# EAGLE design RoverPower (EAGLE 7.1.0)
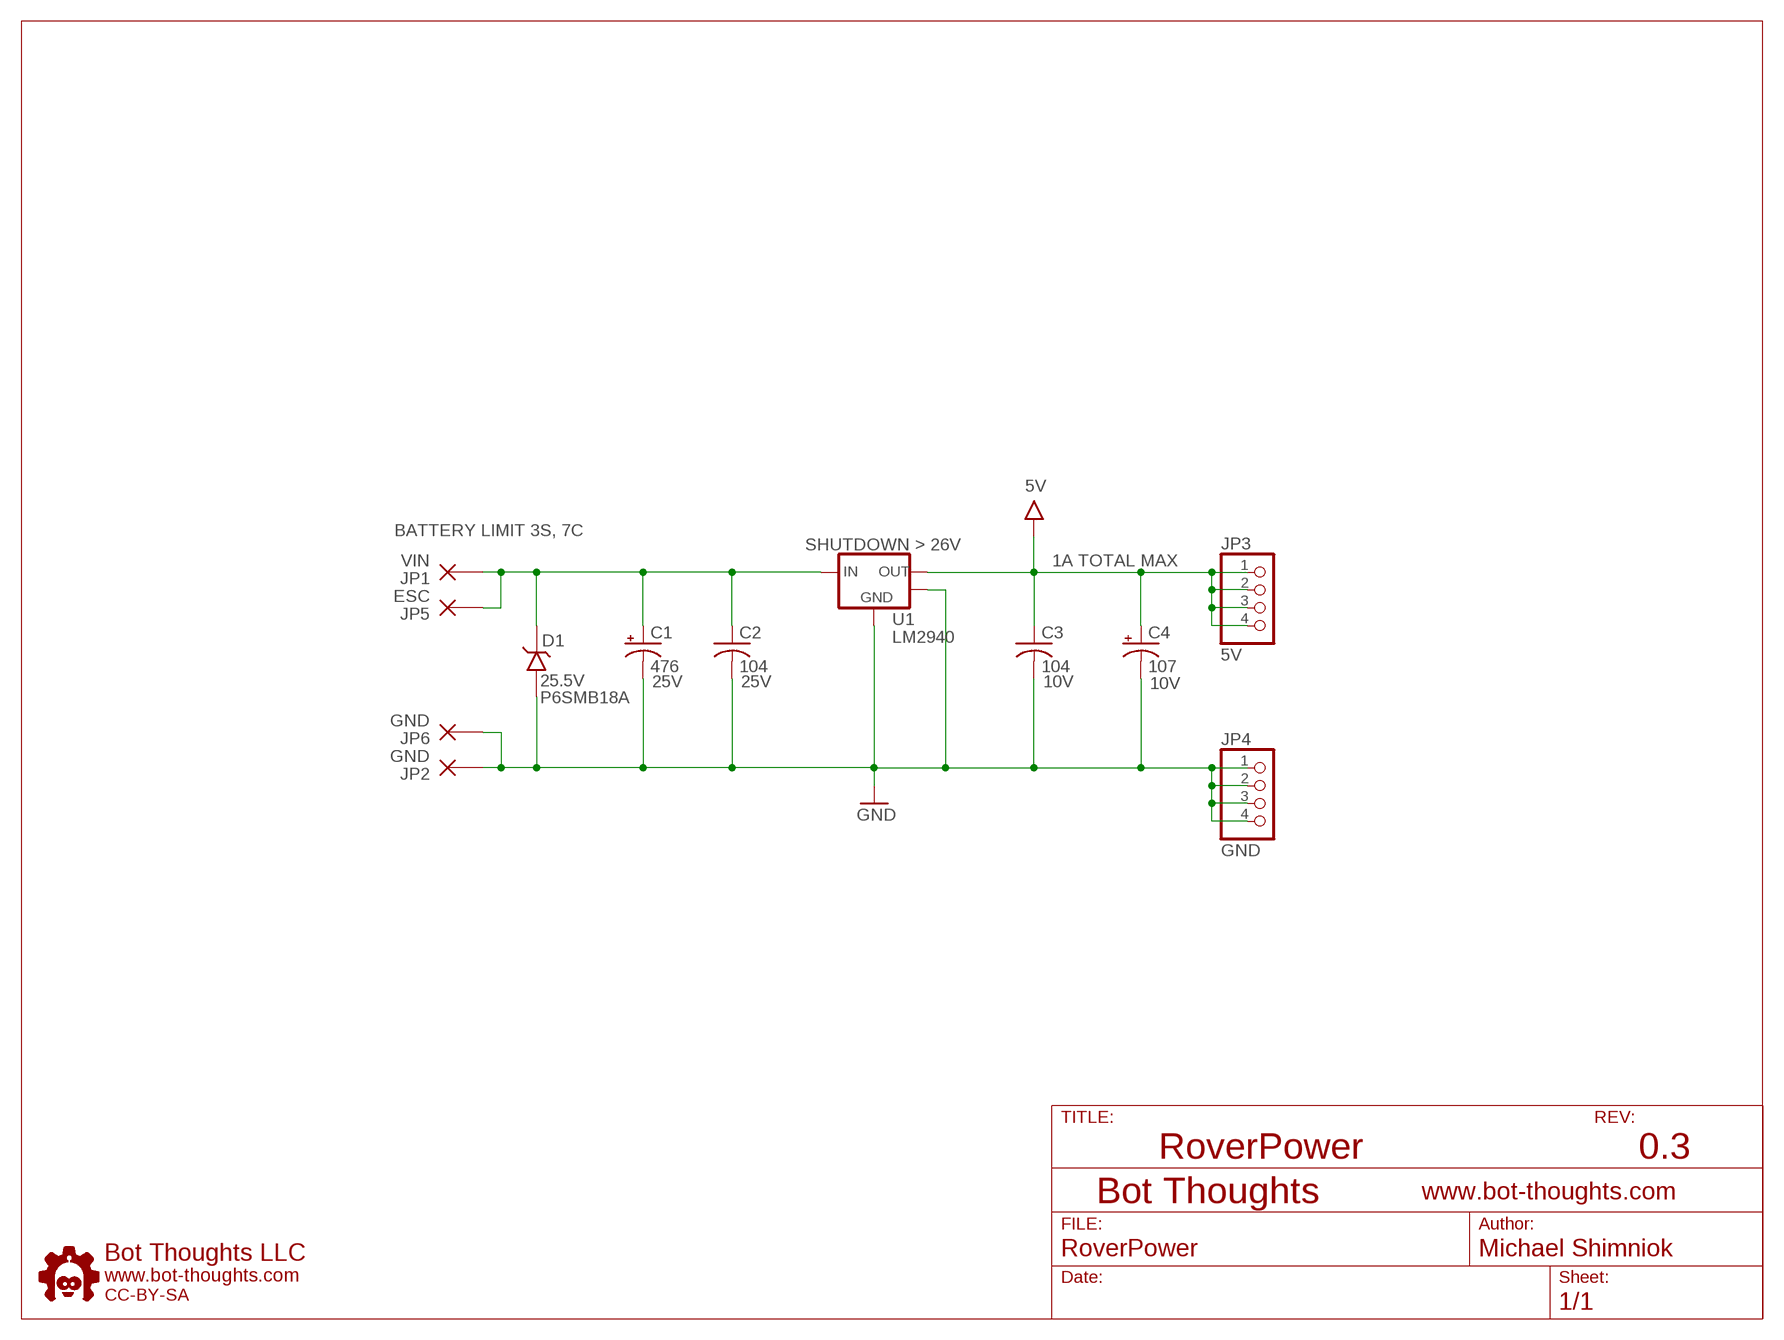
[diagram p0: schematic, sheet 1]

## Parts
C1  476  CPOL-USE2.5-6  [E2,5-6]
C2  104  C-USC0603  [C0603]
C3  104  C-USC0603  [C0603]
C4  107  CPOL-USSMCB  [SMC_B]
D1  25.5V  P6SMBXXAT3GSMA  [DO-214AA]
JP1  VIN  WIREPAD_12GA  [PAD_12GA]
JP2  GND  WIREPAD_12GA  [PAD_12GA]
JP3  5V  PINHD-1X04_2.54-S  [1X04-S]
JP4  GND  PINHD-1X04_2.54-S  [1X04-S]
JP5  ESC  WIREPAD_12GA  [PAD_12GA]
JP6  GND  WIREPAD_12GA  [PAD_12GA]
U1  LM2940  LM2940KTT  [TO263-3]
U$2  BTLOGO-LOGO-MD  [BTLOGOM]

## Nets
5V: C3.1 C4.+ JP3.1 JP3.2 JP3.3 JP3.4 U1.3(VOUT)
BAT+: C1.+ C2.1 D1.P$1(C) JP1.P$1(P) JP5.P$1(P) U1.1(VIN)
GND: C1.- C2.2 C3.2 C4.- D1.P$2(A) JP2.P$1(P) JP4.1 JP4.2 JP4.3 JP4.4 JP6.P$1(P) U1.2(GND) U1.4(TAB)

## Notes on the sheet
- BATTERY LIMIT 3S, 7C
- SHUTDOWN > 26V
- 1A TOTAL MAX
- RoverPower | 0.3

## Library data of the parts
C1 = rcl:CPOL-US: POLARIZED CAPACITOR, American symbol; PARTNO: EEU-FC1H470; VOLTAGE: 25V
C2 = rcl:C-US: CAPACITOR, American symbol; VOLTAGE: 25V
C3 = rcl:C-US: CAPACITOR, American symbol; VOLTAGE: 10V
C4 = rcl:CPOL-US: POLARIZED CAPACITOR, American symbol; VOLTAGE: 10V
D1 = bt_diode:P6SMBXXAT3G: SMBxxAT3G TVS Diode The SMB series is designed to protect voltage sensitive components from high voltage, high energy transients. They have excellent clamping capability, high surge capability, low zener impedance and fast response time. The SMB series is supplied in ON Semiconductor’s exclusive, cost-effective, highly reliable SURMETIC® package and is ideally suited for use in communication systems, automotive, numerical controls, process controls, medical equipment, business machines, power supplies and many other industrial/consumer applications. http://www.onsemi.com/pub_link/Collateral/P6SMB6.8AT3-D.PDF <datasheet.pdf>; PARTNO: P6SMB18A
JP1 JP2 JP5 JP6 = bt_electromech:WIREPAD: PIN PAD (PINPAD) Generic pin pad connector
JP3 JP4 = pinhead-2:PINHD-1X04: PIN HEADER
U1 = bt_regulator:LM2940: LM2940 LDO Voltage Regulator The LM2940-N/LM2940C positive voltage regulator features the ability to source 1A of output current with a dropout voltage of typically 0.5V and a maximum of 1V over the entire temperature range. Furthermore, a quiescent current reduction circuit has been included which reduces the ground current when the differential between the input voltage and the output exceeds approximately 3V. Designed also for vehicular applications, the LM2940-N/LM2940C and all regulated circuitry are protected from reverse battery installations or 2-battery jumps. During line transients, such as load dump when the input voltage can momentarily exceed the specified maximum operating voltage, the regulator will automatically shut down to protect both the internal circuits and the load. The LM2940/LM2940C cannot be harmed by temporary mirror-image insertion. Familiar regulator features such as short circuit and thermal overload protection are also provided. Datasheet.pdf <http://www.ti.com/lit/ds/symlink/lm2940-n.pdf>
U$2 = bt:BTLOGO: Bot Thoughts Logo

## Board
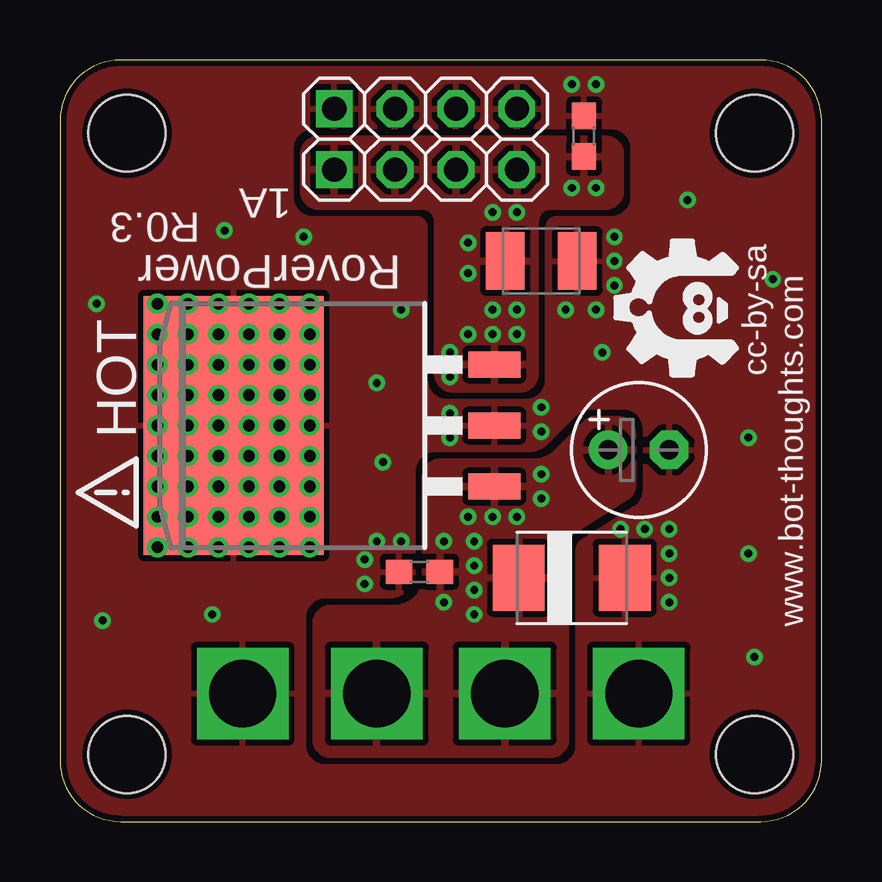
[diagram p1: board, top side]
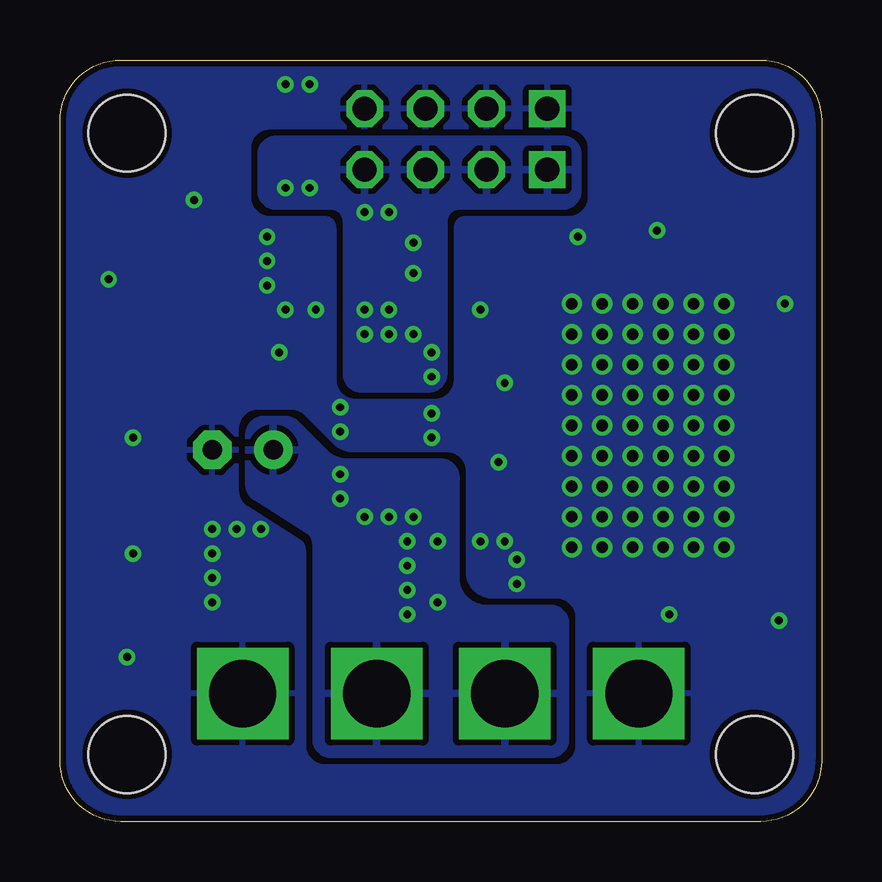
[diagram p2: board, bottom side, seen from below]

Size 31.75 x 31.75 mm. Coordinates in mm from the lower left corner, seen from the top.
Outline: 0,29.21 0,2.54 arc90 2.54,0 29.21,0 arc90 31.75,2.54 31.75,29.21 arc90 29.21,31.75 2.54,31.75 arc90 0,29.21
Copper layers (1*16): Top 0.0356mm / dielectric 1.5011mm / Bottom 0.0356mm
Design rules "LaenPCBOrder": minimum track width 6mil, minimum drill 13mil, track to track 10mil, track to pad 10mil, pad to pad 10mil, via to via 10mil, smd to smd 8mil, copper to edge 10mil, drill to drill 10mil, minimum pad ring 7mil, minimum via ring 7mil, stop-mask expansion 3mil, vias tented up to drill 20mil, thermal gap 10mil
Holes 3.2 mm at 2.79,2.79 28.96,2.79 28.96,28.7 2.79,28.7

### Footprints (pad centres in the part's own frame; a part is rotated, then mirrored left to right if it is on the bottom)
E2,5-6 = drill 0.813 pad 1.6: + -1.27,0 | drill 0.813 pad 1.6 octagon: - 1.27,0
C0603 = smd 1.1 x 1: 1 -0.85,0; 2 0.85,0
SMC_B = smd 1.6 x 2.4: + -1.5,0; - 1.5,0
DO-214AA = smd 2.159 x 2.743: P$1 -2.21,0; P$2 2.21,0
PAD_12GA = drill 2.8 square: P$1 0,0
1X04-S = drill 1.016 square: 1 -3.81,0 | drill 1.016 octagon: 2 -1.27,0; 3 1.27,0; 4 3.81,0
TO263-3 = smd 1.067 x 2.159: 1 -2.54,-7.061; 2 0,-7.061; 3 2.54,-7.061 | smd 10.795 x 7.493: 4 0,3.81

### Placement (x,y rotation side)
C1  24.13,15.49 0 top
C2  14.99,10.41 180 top
C3  21.84,28.57 90 top
C4  20.07,23.37 0 top
D1  21.34,10.16 0 top
JP1  18.54,5.33 90 top
JP2  24.13,5.33 270 top
JP3  15.24,27.18 0 top
JP4  15.24,29.72 0 top
JP5  13.21,5.33 90 top
JP6  7.62,5.33 270 top
U1  11.05,16.51 90 top
U$2  28.45,21.34 90 top

### Tracks (layer width: path | path; a pad name or v marks a point on that pad's centre or on a via)
5V  (via drill 0.33)
  other vias: 19.05,21.34 18.03,21.34 17.02,22.86 17.02,24.13 18.03,25.4 19.05,25.4 16.26,18.54 16.26,19.56 17.02,20.32 18.03,20.32 19.05,20.32 21.34,26.42 22.35,26.42
  pour Top: 10.16,26.29 10.16,27.81 arc-90 10.79,28.45 22.73,28.45 arc-90 23.37,27.81 23.37,26.29 arc-90 22.73,25.65 20.45,25.65 arc90 19.81,25.02 19.81,18.67 arc-90 19.18,18.03 16.38,18.03 arc-90 15.75,18.67 15.75,25.02 arc90 15.11,25.65 10.79,25.65 arc-90
  pour Bottom: 10.16,26.29 10.16,27.81 arc-90 10.79,28.45 22.73,28.45 arc-90 23.37,27.81 23.37,26.29 arc-90 22.73,25.65 20.45,25.65 arc90 19.81,25.02 19.81,18.67 arc-90 19.18,18.03 16.38,18.03 arc-90 15.75,18.67 15.75,25.02 arc90 15.11,25.65 10.79,25.65 arc-90
BAT+  (via drill 0.33)
  other vias: 20.07,14.48 20.07,13.46 19.05,12.7 18.03,12.7 17.02,12.7 17.27,11.68 17.27,10.67 17.27,9.65 17.27,8.64 16,11.68 16,9.14
  pour Top: 15.88,14.99 19.79,14.99 arc45 20.69,15.36 21.91,16.58 arc-45 22.36,16.76 23.24,16.76 arc-90 23.88,16.13 23.88,14.06 arc-58 23.58,13.53 21.38,12.13 arc58 21.08,11.59 21.08,3.43 arc-90 20.45,2.79 11.3,2.79 arc-90 10.67,3.43 10.67,8.26 arc-90 11.3,8.89 13.97,8.89 arc90 15.24,10.16 15.24,14.35 arc-90
  pour Bottom: 15.88,14.99 19.79,14.99 arc45 20.69,15.36 21.91,16.58 arc-45 22.36,16.76 23.24,16.76 arc-90 23.88,16.13 23.88,14.06 arc-58 23.58,13.53 21.38,12.13 arc58 21.08,11.59 21.08,3.43 arc-90 20.45,2.79 11.3,2.79 arc-90 10.67,3.43 10.67,8.26 arc-90 11.3,8.89 13.97,8.89 arc90 15.24,10.16 15.24,14.35 arc-90
GND  (via drill 0.33, 0.48)
  other vias: 10.41,16.51 9.14,16.51 6.6,16.51 5.33,16.51 7.87,20.32 10.41,20.32 9.14,20.32 6.6,20.32 5.33,20.32 7.87,19.05 10.41,19.05 9.14,19.05 6.6,19.05 5.33,19.05 7.87,17.78 10.41,17.78 9.14,17.78 6.6,17.78 5.33,17.78 7.87,15.24 10.41,15.24 9.14,15.24 6.6,15.24 5.33,15.24 7.87,13.97 10.41,13.97 9.14,13.97 6.6,13.97 5.33,13.97 7.87,12.7 10.41,12.7 9.14,12.7 6.6,12.7 5.33,12.7 9.14,11.43 5.33,11.43 6.6,11.43 7.87,11.43 10.41,11.43 4.06,11.43 4.06,12.7 4.06,13.97 4.06,15.24 4.06,16.51 4.06,17.78 4.06,19.05 4.06,20.32 4.06,21.59 5.33,21.59 6.6,21.59 7.87,21.59 9.14,21.59 10.41,21.59 7.87,16.51 16.26,17.02 16.26,16 20.07,16.26 20.07,17.27 21.08,21.34 22.35,21.34 23.11,24.38 23.11,23.37 23.11,22.35 14.22,11.68 13.21,11.68 12.7,10.92 12.7,9.91 23.37,12.19 24.38,12.19 25.4,12.19 25.4,11.18 25.4,10.16 25.4,9.14 13.46,14.99 13.21,18.29 14.22,21.34 1.78,8.38 6.35,8.64 28.7,16 26.16,25.91 22.61,19.56 28.7,11.18 6.86,24.64 1.52,21.59 10.16,24.38 29.72,22.61 28.96,6.86 22.35,30.73 21.34,30.73
  pour Bottom (rank 6): 29.21,0 2.54,0 arc-90 0,2.54 0,29.21 arc-90 2.54,31.75 29.21,31.75 arc-90 31.75,29.21 31.75,2.54 arc-90
  pour Top (rank 3): 29.21,0 2.54,0 arc-90 0,2.54 0,29.21 arc-90 2.54,31.75 29.21,31.75 arc-90 31.75,29.21 31.75,2.54 arc-90

### Text on the board
tPlace: HOT
tNames: 1A | R0.3 | RoverPower | cc-by-sa | www.bot-thoughts.com
tsilk: GND | 106 | 5V | 1A | R0.2 | RoverPower | 107 | 107 | HOT | LM2940 | 106 | 13.6V | www.bot-thoughts.com | GND | ESC | VIN | GND